# Altium schematic sheet Display.SchDoc
size A4; SheetNumber: 5; SheetTotal: 5
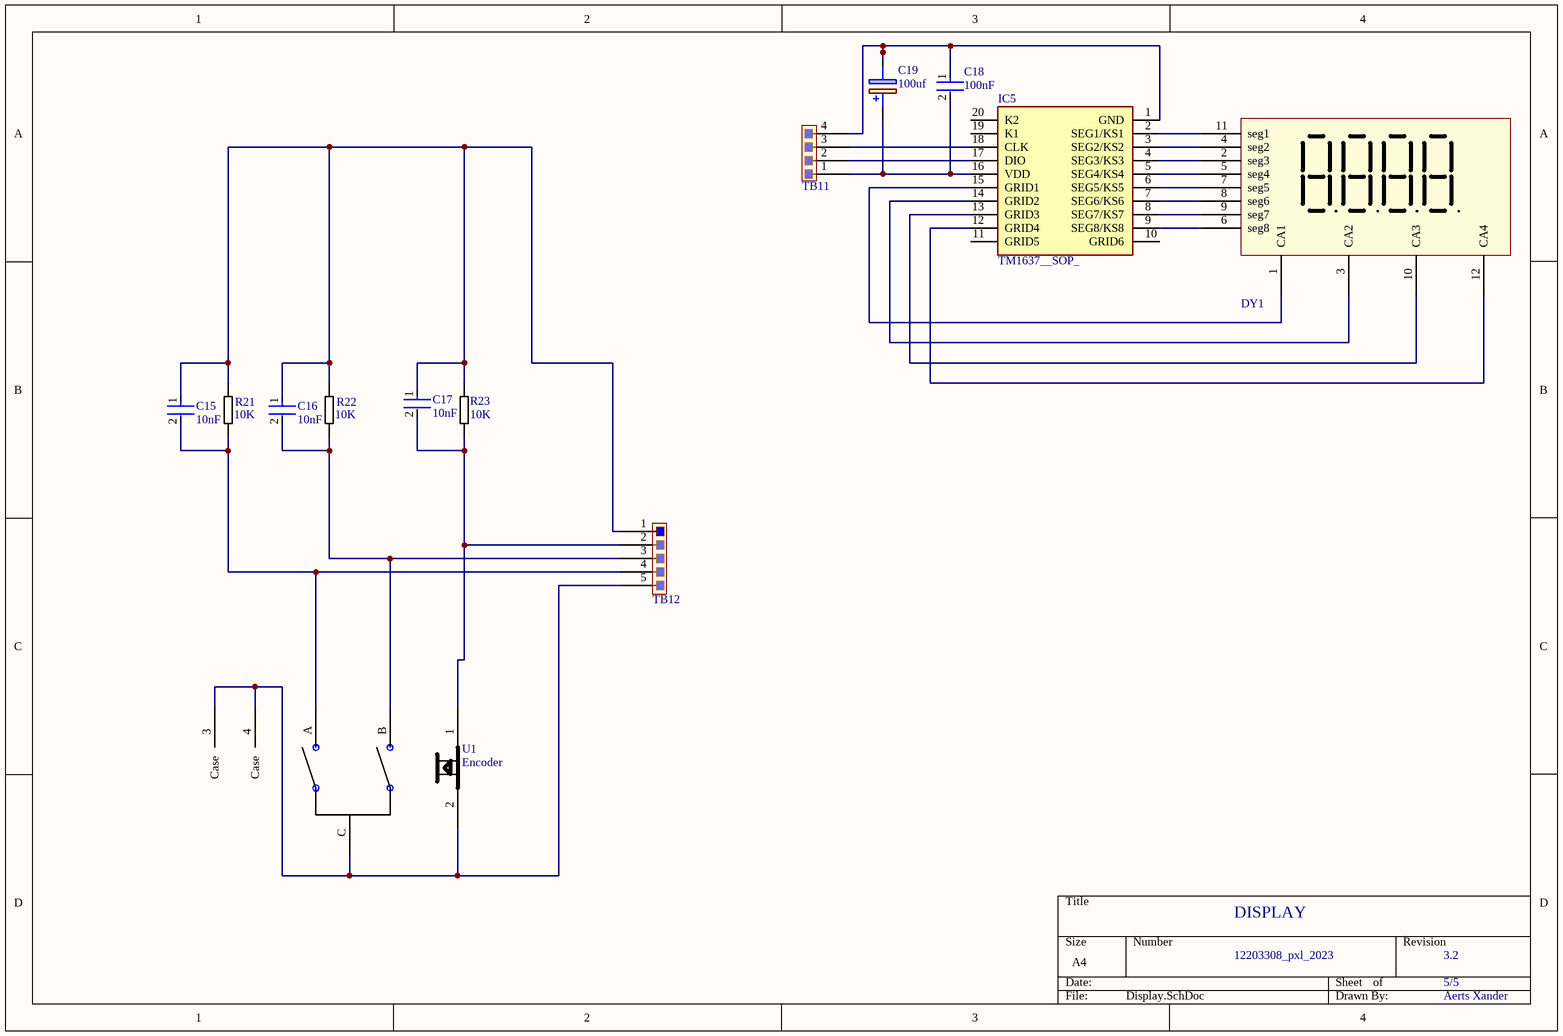
[diagram p0: Display.SchDoc]

## Parts
C15  10nF  [0805]
C16  10nF  [0805]
C17  10nF  [0805]
C18  100nF  [0805]
C19  100uf  [100uf tht]
DY1  4 x sevensegment display  [4 x sevensegment display]  (value not drawn)
IC5  TM1637__SOP_  [sop]
R21  10K  [0805]
R22  10K  [0805]
R23  10K  [0805]
TB11  4x1 header tht  [4x1 header tht]  (value not drawn)
TB12  5x1 header tht  [5x1 header tht]  (value not drawn)
U1  Encoder  [Encoder]

## Nets
NetC15_1: C15.1 C16.1 C17.1 R21.2 R22.2 R23.2 TB12.1
NetC15_2: C15.2 R21.1 TB12.4 U1.A
NetC16_2: C16.2 R22.1 TB12.3 U1.B
NetC17_2: C17.2 R23.1 TB12.2 U1.1(SW1)
NetC18_1: C18.1 C19.2(-) IC5.1(GND) TB11.4
NetC18_2: C18.2 C19.1(+) IC5.16(VDD) TB11.1
NetDY1_1: DY1.1(CA1) IC5.15(GRID1)
NetDY1_2: DY1.2(seg3) IC5.4(SEG3/KS3)
NetDY1_3: DY1.3(CA2) IC5.14(GRID2)
NetDY1_4: DY1.4(seg2) IC5.3(SEG2/KS2)
NetDY1_5: DY1.5(seg4) IC5.5(SEG4/KS4)
NetDY1_6: DY1.6(seg8) IC5.9(SEG8/KS8)
NetDY1_7: DY1.7(seg5) IC5.6(SEG5/KS5)
NetDY1_8: DY1.8(seg6) IC5.7(SEG6/KS6)
NetDY1_9: DY1.9(seg7) IC5.8(SEG7/KS7)
NetDY1_10: DY1.10(CA3) IC5.13(GRID3)
NetDY1_11: DY1.11(seg1) IC5.2(SEG1/KS1)
NetDY1_12: DY1.12(CA4) IC5.12(GRID4)
NetIC5_17: IC5.17(DIO) TB11.2
NetIC5_18: IC5.18(CLK) TB11.3
NetTB12_5: TB12.5 U1.2(SW2) U1.3(Case) U1.4(Case) U1.C

Not connected (* = marked no-connect by the designer): IC5 10(GRID6) 11(GRID5) 19(K1) 20(K2)

## Notes on the sheet
- DISPLAY
- 12203308_pxl_2023
- 3.2
- 5/5
- Aerts Xander

## Library data of the parts
C15-C17 = Capacitor 0805: CAP CER 10000PF 50V X7R 0603; Manufacturer Part Number: CC0603KRX7R9BB103; Manufacturer: YAGEO; Tolerance: 0.1; Material: Ceramic; Temperature Coefficient: 15%; Mouser Description: Multilayer Ceramic Capacitor, CC Series, 0.01 - F, - 10%, X7R, 50 V, 0603 [1608 Metric]; Digikey Description: CAP CER 10000PF 50V X7R 0603; Height: 0.9mm; Category: Cap; Temperature Characteristic: X7R; Footprint Url: http://www.yageo.com/exep/pages/download/literatures/UPY-C_GEN_24.pdf; Lead Free: Yes; Voltage Rating: 50 V; Temperature: -55°C to +125°C; Device Class L3: Ceramic Capacitors; ComponentLink2Description: Datasheet; Voltage: 50 V; Package: CC0603-DA; Octopart: https://octopart.com/cc0603krx7r9bb103-yageo-192938; Automotive: No; Temperature Range High: +125°C; Temperature Range Low: -55°C; Value: 10 nF; RoHS: TRUE; Device Class L1: Passive Components; ComponentLink2URL: http://www.yageo.com/documents/recent/UPY-GPHC_X7R_6.3V-to-50V_18.pdf; Device Class L2: Capacitors; Capacitance: 10 nF
C18 = Capacitor 0805: CAP CER 10000PF 50V X7R 0603; Manufacturer Part Number: CC0603KRX7R9BB103; Manufacturer: YAGEO; Tolerance: 0.1; Material: Ceramic; Temperature Coefficient: 15%; Value: 10 nF; Mouser Description: Multilayer Ceramic Capacitor, CC Series, 0.01 - F, - 10%, X7R, 50 V, 0603 [1608 Metric]; Digikey Description: CAP CER 10000PF 50V X7R 0603; Height: 0.9mm; Category: Cap; Temperature Characteristic: X7R; Footprint Url: http://www.yageo.com/exep/pages/download/literatures/UPY-C_GEN_24.pdf; Lead Free: Yes; Voltage Rating: 50 V; Temperature: -55°C to +125°C; Device Class L3: Ceramic Capacitors; ComponentLink2Description: Datasheet; Voltage: 50 V; Package: CC0603-DA; Octopart: https://octopart.com/cc0603krx7r9bb103-yageo-192938; Automotive: No; Temperature Range High: +125°C; Temperature Range Low: -55°C; RoHS: TRUE; Device Class L1: Passive Components; ComponentLink2URL: http://www.yageo.com/documents/recent/UPY-GPHC_X7R_6.3V-to-50V_18.pdf; Device Class L2: Capacitors; Capacitance: 10 nF
C19 = 100uf tht: Aluminum Electrolytic Capacitors - Radial Leaded 50V 100uF 20%-MAL213631101E3; Manufacturer_Name: Vishay; Geometry.Height: 13.5mm; Mouser Part Number: 594-MAL213631101E3; Mouser Price/Stock: https://www.mouser.co.uk/ProductDetail/Vishay-BC-Components/MAL213631101E3?qs=aJI9t0tCUiXeynxOmA%252BOhg%3D%3D; Manufacturer_Part_Number: MAL213631101E3; Datasheet Link: https://componentsearchengine.com/Datasheets/2/MAL213631101E3.pdf
IC5 = TM1637__SOP_: Integrated Circuit; Manufacturer_Name: TITAN MICRO ELECTRONICS; Manufacturer_Part_Number: TM1637 (SOP); Datasheet Link: https://www.mcielectronics.cl/website_MCI/static/documents/Datasheet_TM1637.pdf; Height: 2.8mm
R21-R23 = resistor: Manufacturer: Vishay Dale; Part Number: CRCW08050000Z0EA